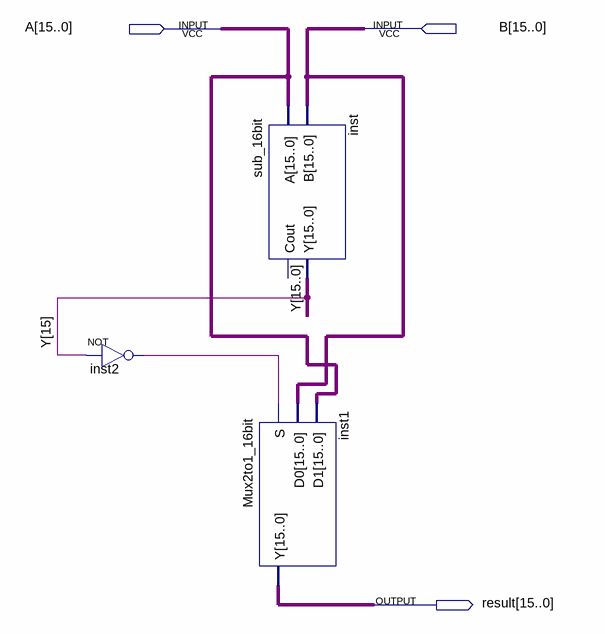
[diagram p0: schematic sheet]
// Quartus schematic MAX.bdf as structural Verilog: 3 symbols, 3 pins
module MAX (
  input  [15:0] A,
  input  [15:0] B,
  output [15:0] result
);

  wire inst2_out;
  wire [15:0] Y;

  not inst2 (inst2_out, Y[15]);
  sub_16bit inst (.A(A), .B(B), .Y(Y));  // open: Cout
  Mux2to1_16bit inst1 (.S(inst2_out), .D0(B), .D1(A), .Y(result));
endmodule
